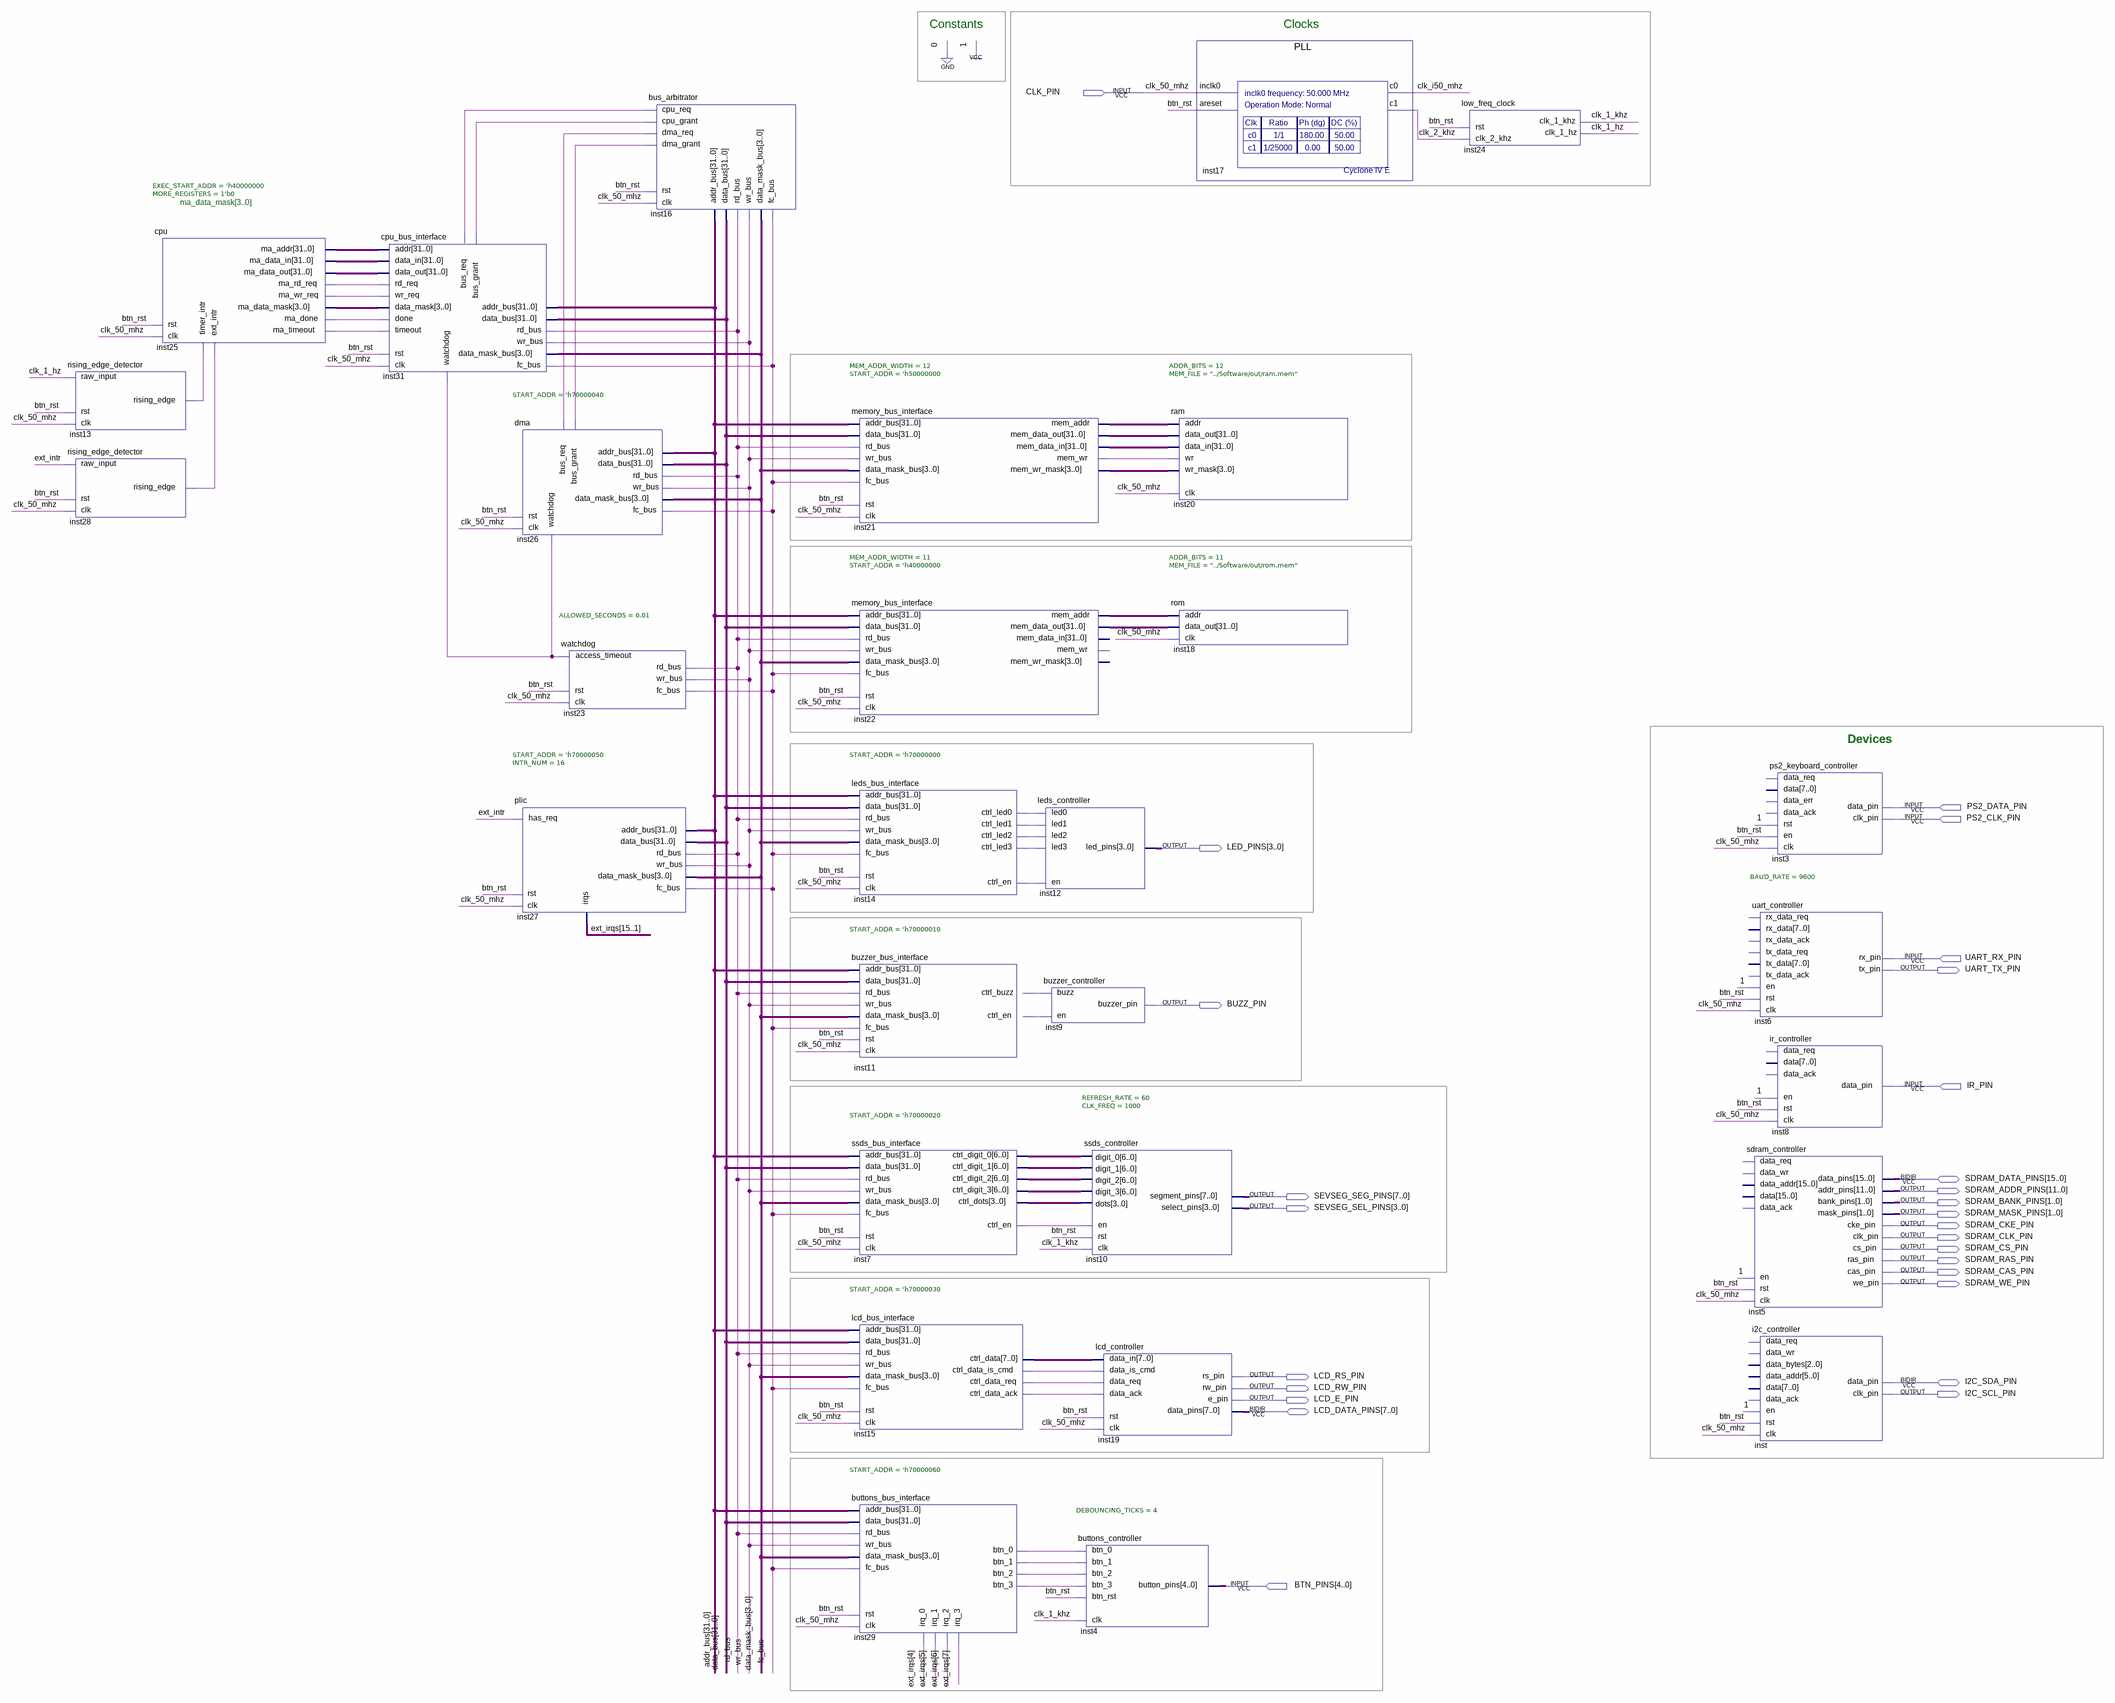
[diagram p0: schematic sheet]
// Quartus schematic Niski.bdf as structural Verilog: 29 symbols, 27 pins
module Niski (
  input  CLK_PIN,
  input  PS2_DATA_PIN,
  input  PS2_CLK_PIN,
  input  UART_RX_PIN,
  input  IR_PIN,
  input  [4:0] BTN_PINS,
  inout  [15:0] SDRAM_DATA_PINS,
  inout  I2C_SDA_PIN,
  inout  [7:0] LCD_DATA_PINS,
  output [3:0] LED_PINS,
  output UART_TX_PIN,
  output BUZZ_PIN,
  output [11:0] SDRAM_ADDR_PINS,
  output [7:0] SEVSEG_SEG_PINS,
  output [1:0] SDRAM_BANK_PINS,
  output [3:0] SEVSEG_SEL_PINS,
  output [1:0] SDRAM_MASK_PINS,
  output SDRAM_CKE_PIN,
  output SDRAM_CLK_PIN,
  output SDRAM_CS_PIN,
  output SDRAM_RAS_PIN,
  output SDRAM_CAS_PIN,
  output SDRAM_WE_PIN,
  output LCD_RS_PIN,
  output LCD_RW_PIN,
  output I2C_SCL_PIN,
  output LCD_E_PIN
);

  wire btn_rst, clk_1_hz, clk_1_khz, clk_2_khz, clk_i50_mhz, ext_intr, fc_bus, inst4_btn_0, inst4_btn_1,
       inst4_btn_2, inst4_btn_3, inst7_ctrl_en, inst11_ctrl_buzz, inst11_ctrl_en, inst13_rising_edge,
       inst14_ctrl_en, inst14_ctrl_led0, inst14_ctrl_led1, inst14_ctrl_led2, inst14_ctrl_led3,
       inst15_ctrl_data_is_cmd, inst15_ctrl_data_req, inst16_cpu_grant, inst16_dma_grant, inst19_data_ack,
       inst21_mem_wr, inst23_access_timeout, inst25_ma_rd_req, inst25_ma_wr_req, inst26_bus_req,
       inst28_rising_edge, inst31_bus_req, inst31_done, inst31_timeout, rd_bus, wr_bus;
  wire [3:0] data_mask_bus, inst7_ctrl_dots, inst21_mem_wr_mask, inst25_ma_data_mask;
  wire [6:0] inst7_ctrl_digit_0, inst7_ctrl_digit_1, inst7_ctrl_digit_2, inst7_ctrl_digit_3;
  wire [7:0] inst15_ctrl_data;
  wire [10:0] inst22_mem_addr;
  wire [11:0] inst21_mem_addr;
  wire [15:1] ext_irqs;
  wire [31:0] addr_bus, data_bus, inst18_data_out, inst20_data_out, inst21_mem_data_in, inst25_ma_addr,
       inst25_ma_data_out, inst31_data_in;

  rising_edge_detector inst13 (.clk(CLK_PIN), .rst(btn_rst), .raw_input(clk_1_hz), .rising_edge(inst13_rising_edge));
  rising_edge_detector inst28 (.clk(CLK_PIN), .rst(btn_rst), .raw_input(ext_intr), .rising_edge(inst28_rising_edge));
  cpu #(.EXEC_START_ADDR('h40000000), .MORE_REGISTERS(1'b0)) inst25 (
    .clk(CLK_PIN), .rst(btn_rst), .ma_data_in(inst31_data_in), .ma_done(inst31_done),
    .ma_timeout(inst31_timeout), .timer_intr(inst13_rising_edge), .ext_intr(inst28_rising_edge),
    .ma_addr(inst25_ma_addr), .ma_data_out(inst25_ma_data_out), .ma_rd_req(inst25_ma_rd_req),
    .ma_wr_req(inst25_ma_wr_req), .ma_data_mask(inst25_ma_data_mask));
  cpu_bus_interface inst31 (
    .clk(CLK_PIN), .rst(btn_rst), .bus_grant(inst16_cpu_grant), .fc_bus(fc_bus), .wr_req(inst25_ma_wr_req),
    .rd_req(inst25_ma_rd_req), .addr(inst25_ma_addr), .data_out(inst25_ma_data_out),
    .data_mask(inst25_ma_data_mask), .watchdog(inst23_access_timeout), .bus_req(inst31_bus_req),
    .addr_bus(addr_bus), .rd_bus(rd_bus), .wr_bus(wr_bus), .data_mask_bus(data_mask_bus),
    .data_in(inst31_data_in), .done(inst31_done), .timeout(inst31_timeout), .data_bus(data_bus));
  dma #(.START_ADDR('h70000040)) inst26 (
    .clk(CLK_PIN), .rst(btn_rst), .bus_grant(inst16_dma_grant), .watchdog(inst23_access_timeout),
    .bus_req(inst26_bus_req), .addr_bus(addr_bus), .data_bus(data_bus), .rd_bus(rd_bus), .wr_bus(wr_bus),
    .data_mask_bus(data_mask_bus), .fc_bus(fc_bus));
  plic #(.START_ADDR('h70000050), .INTR_NUM(16)) inst27 (
    .clk(CLK_PIN), .rst(btn_rst), .addr_bus(addr_bus), .rd_bus(rd_bus), .wr_bus(wr_bus),
    .data_mask_bus(data_mask_bus), .irqs(ext_irqs), .has_req(ext_intr), .fc_bus(fc_bus), .data_bus(data_bus));
  watchdog #(.ALLOWED_SECONDS(0.01)) inst23 (
    .clk(CLK_PIN), .rst(btn_rst), .rd_bus(rd_bus), .wr_bus(wr_bus), .fc_bus(fc_bus),
    .access_timeout(inst23_access_timeout));
  bus_arbitrator inst16 (
    .clk(CLK_PIN), .rst(btn_rst), .cpu_req(inst31_bus_req), .dma_req(inst26_bus_req),
    .cpu_grant(inst16_cpu_grant), .dma_grant(inst16_dma_grant), .addr_bus(addr_bus), .data_bus(data_bus),
    .wr_bus(wr_bus), .rd_bus(rd_bus), .data_mask_bus(data_mask_bus), .fc_bus(fc_bus));
  memory_bus_interface #(.MEM_ADDR_WIDTH(12), .START_ADDR('h50000000)) inst21 (
    .clk(CLK_PIN), .rst(btn_rst), .mem_data_out(inst20_data_out), .addr_bus(addr_bus), .wr_bus(wr_bus),
    .rd_bus(rd_bus), .data_mask_bus(data_mask_bus), .mem_data_in(inst21_mem_data_in), .mem_wr(inst21_mem_wr),
    .mem_wr_mask(inst21_mem_wr_mask), .fc_bus(fc_bus), .mem_addr(inst21_mem_addr), .data_bus(data_bus));
  memory_bus_interface #(.MEM_ADDR_WIDTH(11), .START_ADDR('h40000000)) inst22 (
    .clk(CLK_PIN), .rst(btn_rst), .mem_data_out(inst18_data_out), .addr_bus(addr_bus), .wr_bus(wr_bus),
    .rd_bus(rd_bus), .data_mask_bus(data_mask_bus), .fc_bus(fc_bus), .mem_addr(inst22_mem_addr),
    .data_bus(data_bus));  // open: mem_data_in, mem_wr, mem_wr_mask
  leds_bus_interface #(.START_ADDR('h70000000)) inst14 (
    .clk(CLK_PIN), .rst(btn_rst), .addr_bus(addr_bus), .rd_bus(rd_bus), .wr_bus(wr_bus),
    .data_mask_bus(data_mask_bus), .ctrl_en(inst14_ctrl_en), .ctrl_led0(inst14_ctrl_led0),
    .ctrl_led1(inst14_ctrl_led1), .ctrl_led2(inst14_ctrl_led2), .ctrl_led3(inst14_ctrl_led3),
    .fc_bus(fc_bus), .data_bus(data_bus));
  buzzer_bus_interface #(.START_ADDR('h70000010)) inst11 (
    .clk(CLK_PIN), .rst(btn_rst), .addr_bus(addr_bus), .rd_bus(rd_bus), .wr_bus(wr_bus),
    .data_mask_bus(data_mask_bus), .ctrl_en(inst11_ctrl_en), .ctrl_buzz(inst11_ctrl_buzz), .fc_bus(fc_bus),
    .data_bus(data_bus));
  ssds_bus_interface #(.START_ADDR('h70000020)) inst7 (
    .clk(CLK_PIN), .rst(btn_rst), .addr_bus(addr_bus), .rd_bus(rd_bus), .wr_bus(wr_bus),
    .data_mask_bus(data_mask_bus), .ctrl_en(inst7_ctrl_en), .ctrl_digit_0(inst7_ctrl_digit_0),
    .ctrl_digit_1(inst7_ctrl_digit_1), .ctrl_digit_2(inst7_ctrl_digit_2), .ctrl_digit_3(inst7_ctrl_digit_3),
    .ctrl_dots(inst7_ctrl_dots), .fc_bus(fc_bus), .data_bus(data_bus));
  lcd_bus_interface #(.START_ADDR('h70000030)) inst15 (
    .clk(CLK_PIN), .rst(btn_rst), .ctrl_data_ack(inst19_data_ack), .addr_bus(addr_bus), .rd_bus(rd_bus),
    .wr_bus(wr_bus), .data_mask_bus(data_mask_bus), .ctrl_data(inst15_ctrl_data),
    .ctrl_data_is_cmd(inst15_ctrl_data_is_cmd), .ctrl_data_req(inst15_ctrl_data_req), .fc_bus(fc_bus),
    .data_bus(data_bus));
  buttons_bus_interface #(.START_ADDR('h70000060)) inst29 (
    .clk(CLK_PIN), .rst(btn_rst), .btn_0(inst4_btn_0), .btn_1(inst4_btn_1), .btn_2(inst4_btn_2),
    .btn_3(inst4_btn_3), .addr_bus(addr_bus), .rd_bus(rd_bus), .wr_bus(wr_bus),
    .data_mask_bus(data_mask_bus), .irq_0(ext_irqs[4]), .irq_1(ext_irqs[5]), .irq_2(ext_irqs[6]),
    .irq_3(ext_irqs[7]), .fc_bus(fc_bus), .data_bus(data_bus));
  leds_controller inst12 (
    .en(inst14_ctrl_en), .led0(inst14_ctrl_led0), .led1(inst14_ctrl_led1), .led2(inst14_ctrl_led2),
    .led3(inst14_ctrl_led3), .led_pins(LED_PINS));
  buzzer_controller inst9 (.en(inst11_ctrl_en), .buzz(inst11_ctrl_buzz), .buzzer_pin(BUZZ_PIN));
  ssds_controller #(.REFRESH_RATE(60), .CLK_FREQ(1000)) inst10 (
    .clk(clk_1_khz), .rst(btn_rst), .en(inst7_ctrl_en), .digit_0(inst7_ctrl_digit_0),
    .digit_1(inst7_ctrl_digit_1), .digit_2(inst7_ctrl_digit_2), .digit_3(inst7_ctrl_digit_3),
    .dots(inst7_ctrl_dots), .segment_pins(SEVSEG_SEG_PINS), .select_pins(SEVSEG_SEL_PINS));
  lcd_controller inst19 (
    .clk(CLK_PIN), .rst(btn_rst), .data_in(inst15_ctrl_data), .data_is_cmd(inst15_ctrl_data_is_cmd),
    .data_req(inst15_ctrl_data_req), .rs_pin(LCD_RS_PIN), .e_pin(LCD_E_PIN), .rw_pin(LCD_RW_PIN),
    .data_ack(inst19_data_ack), .data_pins(LCD_DATA_PINS));
  buttons_controller #(.DEBOUNCING_TICKS(4)) inst4 (
    .clk(clk_1_khz), .button_pins(BTN_PINS), .btn_0(inst4_btn_0), .btn_1(inst4_btn_1), .btn_2(inst4_btn_2),
    .btn_3(inst4_btn_3), .btn_rst(btn_rst));
  PLL inst17 (.inclk0(CLK_PIN), .areset(btn_rst), .c0(clk_i50_mhz), .c1(clk_2_khz));
  ram #(.ADDR_BITS(12), .MEM_FILE("../Software/out/ram.mem")) inst20 (
    .clk(CLK_PIN), .wr(inst21_mem_wr), .wr_mask(inst21_mem_wr_mask), .data_in(inst21_mem_data_in),
    .addr(inst21_mem_addr), .data_out(inst20_data_out));
  rom #(.ADDR_BITS(11), .MEM_FILE("../Software/out/rom.mem")) inst18 (
    .clk(CLK_PIN), .addr(inst22_mem_addr), .data_out(inst18_data_out));
  low_freq_clock inst24 (.clk_2_khz(clk_2_khz), .rst(btn_rst), .clk_1_khz(clk_1_khz), .clk_1_hz(clk_1_hz));
  uart_controller #(.BAUD_RATE(9600)) inst6 (
    .clk(CLK_PIN), .rst(btn_rst), .en(1'b1), .rx_pin(UART_RX_PIN), .tx_pin(UART_TX_PIN));  // open: tx_data_req, tx_data, rx_data_req, tx_data_ack, rx_data, rx_data_ack
  sdram_controller inst5 (
    .clk(CLK_PIN), .rst(btn_rst), .en(1'b1), .addr_pins(SDRAM_ADDR_PINS), .bank_pins(SDRAM_BANK_PINS),
    .mask_pins(SDRAM_MASK_PINS), .cke_pin(SDRAM_CKE_PIN), .clk_pin(SDRAM_CLK_PIN), .cs_pin(SDRAM_CS_PIN),
    .ras_pin(SDRAM_RAS_PIN), .cas_pin(SDRAM_CAS_PIN), .we_pin(SDRAM_WE_PIN), .data_pins(SDRAM_DATA_PINS));  // open: data_req, data_wr, data_addr, data_ack, data
  i2c_controller inst (
    .clk(CLK_PIN), .rst(btn_rst), .en(1'b1), .clk_pin(I2C_SCL_PIN), .data_pin(I2C_SDA_PIN));  // open: data_req, data_wr, data_addr, data_bytes, data_ack, data
  ps2_keyboard_controller inst3 (
    .clk(CLK_PIN), .rst(1'b1), .en(btn_rst), .data_pin(PS2_DATA_PIN), .clk_pin(PS2_CLK_PIN));  // open: data_req, data, data_err, data_ack
  ir_controller inst8 (.clk(CLK_PIN), .rst(btn_rst), .en(1'b1), .data_pin(IR_PIN));  // open: data_req, data, data_ack

  // Other names for the same wires on the sheet: clk_50_mhz = CLK_PIN

  // Notes on the sheet:
  //   Constants
  //   Clocks
  //   ma_data_mask[3..0]
  //   Devices
endmodule
